# EasyEDA Pro project PCB.epro

# Board PCB1
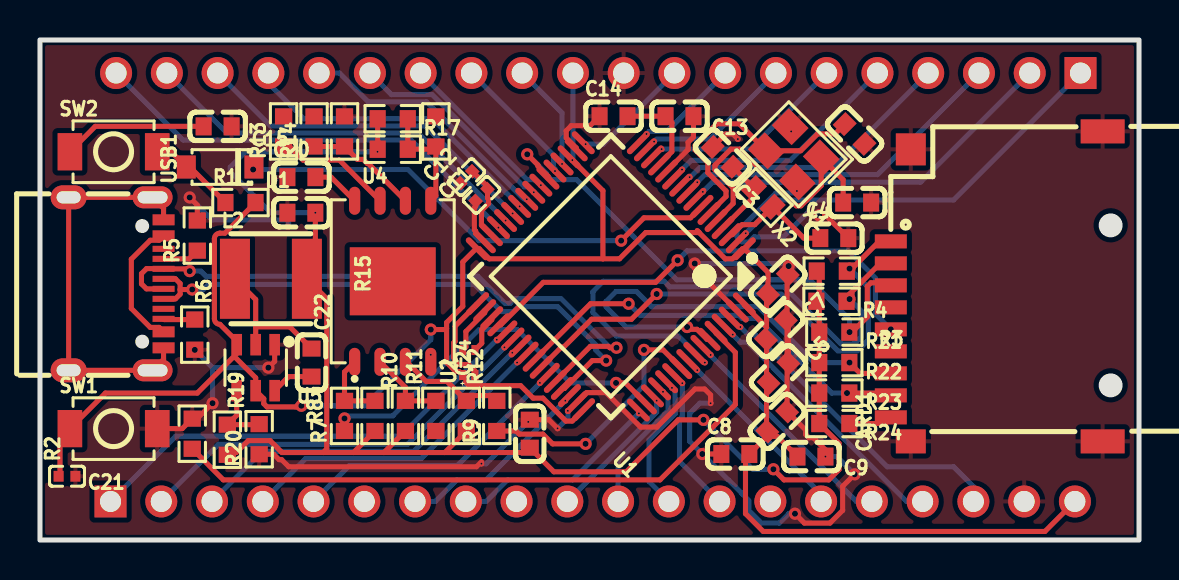
[diagram p0: board, top side]
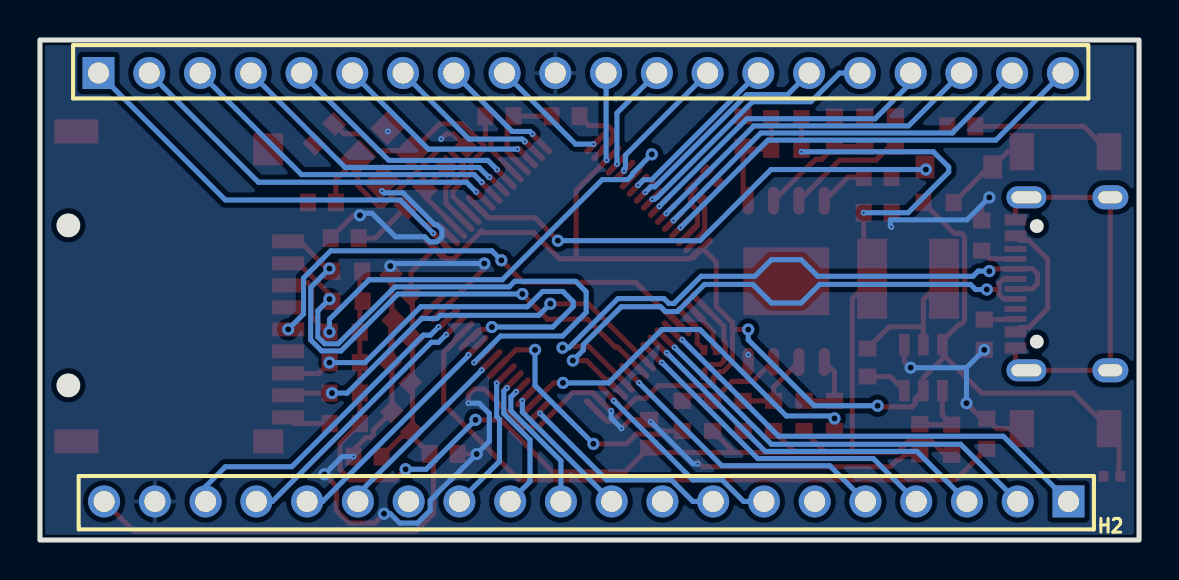
[diagram p1: board, bottom side, seen from below]

Outline 55 x 25 mm; copper layers: Top Layer, Bottom Layer. Coordinates in mm from the lower left corner of the outline.
Outline path: rectangle 0,25 55,0
Stack: Top Layer 0.035mm / Dielectric1 1.51mm FR4 er 4.5 / Bottom Layer 0.035mm

## Design rules (mm)
spacing copperThickness1oz (default): track to track 0.102, other pairs 0.152 to 0.3
spacing copperThickness2oz: track to track 0.203, other pairs 0.152 to 0.3
track width copperThickness1oz (default): min 0.127, default 0.254, max 2.54
track width copperThickness2oz: min 0.203, default 0.254, max 2.54
differential pair differentialPair (default): width min 0.127, default 0.254, max 2.54; gap min 0.152, default 0.152
net GND uses copperRegion

## Placement (name value [footprint] x y rotation side)
C1  20pF  [C0603]  40.77 20.3 135 top
C2  3.9pF  [C0603]  40.89 16.87 0 top
C3  6.8pF  [C0603]  34.16 19.16 135 top
C4  6.8pF  [C0603]  39.75 15.09 0 top
C5  100nF  [C0603]  36.96 8.36 225 top
C6  100nF  [C0603]  36.93 12.79 225 top
C7  100nF  [C0603]  36.83 10.52 225 top
C8  100nF  [C0603]  34.8 4.3 0 top
C9  100nF  [C0603]  38.61 4.17 180 top
C10  100nF  [C0603]  36.89 5.93 225 top
C11  10nF  [C0402]  22.1 17.25 45 top
C12  10nF  [C0402]  21.34 18.14 45 top
C13  100nF  [C0603]  32 21.19 180 top
C14  1uF  [C0603]  28.7 21.19 0 top
C15  100nF  [C0603]  8.89 20.68 180 top
C20  100nF  [C0603]  13.08 18.14 0 top
C21  4.7uF  [C0402]  1.35 3.19 180 top
C22  100nF  [C0603]  13.59 8.87 270 top
C23  100nF  [C0603]  13.08 16.36 0 top
C24  100nF  [C0603]  24.51 5.31 270 top
CARD1  TF PUSH  [TF-SMD_TF-PUSH]  47.88 12.68 90 top
D1  1N4148W  [SOD-123_L2.8-W1.8-LS3.7-RD]  9.02 18.65 180 top
H1  PH2.54-1X20P-H25  [HDR-TH_20P-P2.54-V-M_4]  27.94 23.35 180 bottom
H2  PH2.54-1X20P-H25  [HDR-TH_20P-P2.54-V-M_4]  27.66 1.93 0 bottom
L2  2.2uH  [IND-SMD_L4.0-W4.0_LQH44PN2R2MP0L]  11.56 13.06 0 top
R1  10kΩ  [R0603]  10.03 16.87 0 top
R2  10kΩ  [R0603]  7.62 5.31 90 top
R3  10kΩ  [R0603]  39.62 13.44 180 top
R4  10kΩ  [R0603]  39.61 11.94 180 top
R5  4.7kΩ  [R0603]  7.87 15.22 90 top
R6  4.7kΩ  [R0603]  7.75 10.27 270 top
R7  50  [R0603]  15.24 6.2 90 top
R8  50  [R0603]  19.81 6.2 90 top
R9  50  [R0603]  22.86 6.2 90 top
R10  10kΩ  [R0603]  16.76 6.2 270 top
R11  10kΩ  [R0603]  18.29 6.2 270 top
R12  10kΩ  [R0603]  21.34 6.2 270 top
R13  50  [R0603]  12.19 20.43 90 top
R14  50  [R0603]  13.72 20.43 90 top
R15  50  [R0603]  19.81 20.43 90 top
R16  10kΩ  [R0603]  17.65 19.54 180 top
R17  10kΩ  [R0603]  17.65 21.06 180 top
R18  100kΩ  [R0603]  15.24 20.43 270 top
R19  100kΩ  [R0603]  9.38 5.02 270 top
R20  22.1kΩ  [R0603]  10.97 5.04 90 top
R21  10kΩ  [R0603]  39.75 10.39 180 top
R22  10kΩ  [R0603]  39.75 8.87 180 top
R23  10kΩ  [R0603]  39.75 7.35 180 top
R24  10kΩ  [R0603]  39.75 5.82 180 top
SW1  TS-1088-AR02016  [SW-SMD_L3.9-W3.0-P4.45]  3.68 5.57 0 top
SW2  TS-1088-AR02016  [SW-SMD_L3.9-W3.0-P4.45]  3.68 19.41 0 top
U1  STM32F722RET6  [LQFP-64_L10.0-W10.0-P0.50-LS12.0-BL]  28.58 13.19 135 top
U2  APHF1608LSEEQBDZGKC  [LED-SMD_4P-L1.6-W0.8_APHF1608LSEEQBDZGKC]  21.46 8.87 90 top
U4  W25Q256JVEIQ  [WSON-8_L8.0-W6.10-P1.27-BL-EP]  17.65 12.94 0 top
U5  LMR51430XDDCR  [SOT-23-6_L2.9-W1.6-P0.95-LS2.8-BL]  10.8 8.62 180 top
USB1  TYPE-C 16PIN 2MD(073)  [USB-C-SMD_TYPE-C-16PIN-2MD-073]  3.81 12.81 270 top
X1  25MHz  [CRYSTAL-SMD_4P-L3.2-W2.5-BL]  37.72 19.28 135 top
X2  32.768kHz  [OSC-SMD_2P-L1.6-W1.0]  36.2 17.13 135 top

## Footprints (pads in the part's own frame, mm; a bottom-side part is the same pattern mirrored in y, then rotated)
C0402
  rect 0.5x0.54 smd: 1(-0.42,0) 2(0.42,0)
C0603
  rect 0.8x0.9 smd: 1(-0.7,0) 2(0.7,0)
CRYSTAL-SMD_4P-L3.2-W2.5-BL
  rect 1.4x1.2 smd: 1(-1.1,-0.85) 2(1.1,-0.85) 3(1.1,0.85) 4(-1.1,0.85)
HDR-TH_20P-P2.54-V-M_4
  rect 1.6x1.6 hole 1.05: 1(-24.13,0)
  round 1.6 hole 1.05: 2(-21.59,0) 3(-19.05,0) 4(-16.51,0) 5(-13.97,0) 6(-11.43,0) 7(-8.89,0) 8(-6.35,0) 9(-3.81,0) 10(-1.27,0) 11(1.27,0) 12(3.81,0) 13(6.35,0) 14(8.89,0) 15(11.43,0) 16(13.97,0) 17(16.51,0) 18(19.05,0) 19(21.59,0) 20(24.13,0)
IND-SMD_L4.0-W4.0_LQH44PN2R2MP0L
  rect 1.5x4 smd: 1(-1.8,0) 2(1.8,0)
LED-SMD_4P-L1.6-W0.8_APHF1608LSEEQBDZGKC
  rect 0.5x0.35 smd: 1(-0.625,0.305) 2(-0.625,-0.305) 3(0.625,-0.305) 4(0.625,0.305)
LQFP-64_L10.0-W10.0-P0.50-LS12.0-BL
  oval 0.3x1.5 smd: 1(-3.75,-5.688) 2(-3.25,-5.688) 3(-2.75,-5.688) 4(-2.25,-5.688) 5(-1.75,-5.688) 6(-1.25,-5.688) 7(-0.75,-5.688) 8(-0.25,-5.688) 9(0.25,-5.688) 10(0.75,-5.688) 11(1.25,-5.688) 12(1.75,-5.688) 13(2.25,-5.688) 14(2.75,-5.688) 15(3.25,-5.688) 16(3.75,-5.688) 33(3.75,5.688) 34(3.25,5.688) 35(2.75,5.688) 36(2.25,5.688) 37(1.75,5.688) 38(1.25,5.688) 39(0.75,5.688) 40(0.25,5.688) 41(-0.25,5.688) 42(-0.75,5.688) 43(-1.25,5.688) 44(-1.75,5.688) 45(-2.25,5.688) 46(-2.75,5.688) 47(-3.25,5.688) 48(-3.75,5.688)
  oval 1.5x0.3 smd: 17(5.7,-3.738) 18(5.7,-3.238) 19(5.7,-2.738) 20(5.7,-2.238) 21(5.7,-1.738) 22(5.7,-1.238) 23(5.7,-0.739) 24(5.7,-0.238) 25(5.7,0.262) 26(5.7,0.762) 27(5.7,1.262) 28(5.7,1.762) 29(5.7,2.261) 30(5.7,2.762) 31(5.7,3.261) 32(5.7,3.762) 49(-5.7,3.762) 50(-5.7,3.261) 51(-5.7,2.762) 52(-5.7,2.261) 53(-5.7,1.762) 54(-5.7,1.262) 55(-5.7,0.762) 56(-5.7,0.262) 57(-5.7,-0.238) 58(-5.7,-0.739) 59(-5.7,-1.238) 60(-5.7,-1.738) 61(-5.7,-2.238) 62(-5.7,-2.738) 63(-5.7,-3.238) 64(-5.7,-3.738)
OSC-SMD_2P-L1.6-W1.0
  rect 0.8x1.06 smd: 1(-0.66,0) 2(0.66,0)
R0603
  rect 0.806x0.864 smd: 1(-0.753,0) 2(0.753,0)
SOD-123_L2.8-W1.8-LS3.7-RD
  rect 0.95x1.15 smd: 1(-1.692,0) 2(1.692,0)
SOT-23-6_L2.9-W1.6-P0.95-LS2.8-BL
  rect 0.532x1.072 smd: 1(-0.95,-1.149) 2(0,-1.149) 3(0.95,-1.149) 4(0.95,1.149) 5(0,1.149) 6(-0.95,1.149)
SW-SMD_L3.9-W3.0-P4.45
  rect 1.23x1.86 smd: 1(-2.185,0) 2(2.185,0)
TF-SMD_TF-PUSH
  rect 0.7x1.6 smd: 1(2.25,5.3) 2(1.15,5.3) 3(0.05,5.3) 4(-1.05,5.3) 5(-2.15,5.3) 6(-3.25,5.3) 7(-4.35,5.3) 8(-5.45,5.3) CD(-6.55,5.3)
  rect 1.2x1.5 smd: 10(-7.75,4.3)
  rect 1.2x2.2 smd: 11(-7.75,-5.3) 12(7.75,-5.3)
  rect 1.6x1.5 smd: 13(6.85,4.3)
USB-C-SMD_TYPE-C-16PIN-2MD-073
  oval 1.1x2 hole 0.6x1.5: 13(-4.325,1.825) 14(4.325,1.825)
  oval 1.2x1.8 hole 0.6x1.2: 13(-4.325,-2.375) 14(4.325,-2.375)
  rect 0.55x1.1 smd: A1B12(-3.2,2.375) A4B9(-2.4,2.375) B1A12(3.2,2.375) B4A9(2.4,2.375)
  rect 0.3x1.1 smd: A5(-1.25,2.375) A6(-0.25,2.375) A7(0.25,2.375) A8(1.25,2.375) B5(1.75,2.375) B6(0.75,2.375) B7(-0.75,2.375) B8(-1.75,2.375)
WSON-8_L8.0-W6.10-P1.27-BL-EP
  oval 0.56x1.4 smd: 1(-1.905,-4.027) 2(-0.635,-4.027) 3(0.635,-4.027) 4(1.905,-4.027) 5(1.905,4.027) 6(0.635,4.027) 7(-0.635,4.027) 8(-1.905,4.027)
  rect 4.3x3.4 smd: 9(0,0)

## Nets
+3.3V: C23.2 C24.2 L2.2 R3.2 R4.2 R10.2 R11.2 R12.2 R16.2 R17.2 R19.2 R21.2 R22.2 R23.2 R24.2
GND: C1.1 C2.2 C3.2 C4.2 C5.1 C6.1 C7.1 C8.1 C9.1 C10.1 C11.1 C12.1 C13.1 C14.1 C15.1 C20.1 C21.1 C23.1 C24.1 CARD1.10 CARD1.11 CARD1.12 CARD1.13 H1.10 H2.19 R2.2 R5.2 R6.2 R18.1 R20.1 SW1.2 U1.12 U1.18 U1.31 U1.47 U1.63 U4.4 U5.1 X1.2 X1.4
VCC: C5.2 C6.2 C7.2 C8.2 C9.2 C10.2 C21.2 H1.11 H2.20 R1.2 SW1.1 U1.1 U1.19 U1.32 U1.48 U1.64 U2.1 U5.3 U5.5
VDDA: C13.2 C14.2 U1.13
B: U1.35 U2.3
BOOT: R2.1 U1.60
D+: U1.45 USB1.A6 USB1.B6
D-: U1.44 USB1.A7 USB1.B7
FLASH_CS: R7.1 U1.50
FLASH_IO0: R15.2
FLASH_IO1: R8.1
FLASH_IO2: R9.1 U1.55
FLASH_IO3: R13.2
FLASH_SCK: R14.2
G: U1.34 U2.4
HSE_IN: C2.1 U1.5 X1.1
HSE_OUT: C1.2 U1.6 X1.3
LSE_IN: C4.1 U1.3 X2.1
LSE_OUT: C3.1 U1.4 X2.2
PA0: H1.6 U1.14
PA1: H1.7 U1.15
PA2: H1.8 U1.16
PA3: H1.9 U1.17
PA4: H1.12 U1.20
PA5: H1.13 U1.21
PA7: H1.14 U1.23
PA10: H2.5 U1.43
PA11: H2.6
PA13: H2.7 U1.46
PA14: H2.8 U1.49
PA15: H2.9
PB0: H1.16 U1.25
PB1: H1.17 U1.26
PB2: H1.18 U1.27
PB3: H2.14
PB4: H2.15 U1.56
PB6: H2.16 U1.58
PB8: H2.17 U1.61
PB9: H2.18 U1.62
PB10: H1.19 U1.28
PB11: H1.20 U1.29
PC0: H1.2 U1.8
PC1: H1.3 U1.9
PC2: H1.4 U1.10
PC3: H1.5 U1.11
PC4: H1.15 U1.24
PC6: H2.1 U1.37
PC7: H2.2 U1.38
PC8: H2.3 U1.39
PC9: H2.4 U1.40
PC10: H2.10 U1.51
PC11: H2.11 U1.52
PC12: H2.12 U1.53
PC13: H1.1 U1.2
PD2: H2.13 U1.54
R: U1.33 U2.2
RESET: D1.1 U1.7
SD_CD: CARD1.CD R24.1
SD_CMD: CARD1.3 R21.1 U1.22
SD_DAT0: CARD1.7 R22.1 U1.59
SD_DAT1: CARD1.8 R23.1 U1.41
SD_DAT2: CARD1.1 R3.1 U1.42
SD_DAT3: CARD1.2 R4.1 U1.57
SD_SCK: CARD1.5 U1.36
VCAP: C11.2 C12.2 U1.30
$1N52: D1.2 R1.1 SW2.2
$1N54: C15.2 SW2.1
$1N78: USB1.13 USB1.14 USB1.A1B12 USB1.B1A12
$1N80: USB1.A4B9 USB1.B4A9
$1N83: R5.1 USB1.A5
$1N85: R6.1 USB1.B5
$1N89: R7.2 R10.1 U4.1
$1N90: R8.2 R11.1 U4.2
$1N91: R9.2 R12.1 U4.3
$1N96: R13.1 U4.7
$1N98: R15.1 R16.1 R17.1 U4.5
$1N102: R14.1 R18.2 U4.6
$1N105: C20.2 U4.8
$1N110: C22.2 U5.6
$1N111: C22.1 L2.1 U5.2
$1N112: R19.1 R20.2 U5.4

Pads without a net: CARD1 4 6; U4 9; USB1 A8 B8

## Via types
v1: diameter 0.3, hole 0.1, Top Layer to Bottom Layer, 48 vias
v2: diameter 0.61, hole 0.305, Top Layer to Bottom Layer, 35 vias

## Routing (per net, layer and track width the routed paths; a pad name or vN(x,y) marks a point on that pad's centre or on a via; arc(x,y) is an arc through that point)
+3.3V: length 76.4
  Top Layer w0.254: 20.26,4.37 24.27,4.37 C24.2 25.72,3.41 29.34,3.41 31.94,6.01 v2(33.2,6.01) ; 20.26,4.37 R12.2 ; 20.26,4.37 17.21,4.37 ; v2(36.7,3.54) 37.23,3.01 39.47,3.01 39.99,3.52 39.99,4.83 R24.2 R23.2 R22.2 R21.2 39,13.44 ; R17.2 R16.2 ; 15.69,4.37 17.21,4.37 ; 15.69,4.37 R10.2 ; 15.69,4.37 14.17,4.37 ; 17.21,4.37 R11.2 ; v1(13.78,16.36) 13.78,13.49 13.36,13.06 14.35,12.07 14.35,4.55 14.17,4.37 ; 14.17,4.37 12.11,4.37 11.52,4.97 10.42,4.97 9.83,4.37 9.49,4.37 R19.2
  Bottom Layer w0.254: v2(36.7,3.54) 35.67,3.54 v2(33.2,6.01) ; v1(13.78,16.36) 11.56,16.36 9.52,18.4 9.52,18.65 10.29,19.41 v1(16.89,19.41)
GND: length 103.1
  Top Layer w0.254: v1(33.56,6.84) 33.56,7.25 33.26,7.55 32.78,7.55 30.87,5.64 30.05,5.64 28.33,7.37 27.35,7.37 U1.47 ; R5.2 7.87,16.75 v2(7.49,17.13) ; C14.1 27.53,20.72 26.59,20.72 26.33,20.47 26.33,20.11 26.83,19.61 26.83,19.51 ; U5.1 11.74,8.93 v2(11.43,8.62) ; 40.45,15.09 39.31,16.24 v2(38.99,16.24) ; R20.1 11.69,4.29 11.96,4.02 12.09,4.02 12.45,3.66 21.84,3.66 22.1,3.92 ; 37.42,13.28 37.39,13.25 C10.1 38.32,5.5 38.32,5.28 38.48,5.11 38.7,5.11 39.31,4.51 v1(39.31,4.17) ; 25.91,5.57 25.46,6.02 C24.1 ; 22.24,14.91 21.8,15.35 21.8,15.45 21.74,15.52 21.74,16.62 21.8,16.68 21.8,16.96 ; v2(8.64,6.84) 7.87,6.07 R2.2 7.12,5.57 SW1.2 ; C3.2 34.32,20.3 34.67,20.3 v1(34.92,20.05) ; v2(40.77,3.28) 40.17,2.69 40.17,1.48 39.54,0.85 38.25,0.85 v2(37.78,1.31) ; U1.12 32.43,19.52 32.43,19.88 32.7,20.15 C13.1 ; U1.63 32.77,13.58 v2(32.77,13.82) ; C8.1 v2(33.15,4.3) ; C5.1 37.45,11.02
  Bottom Layer w0.254: 8.64,8.62 v2(7.75,9.51) ; 8.64,8.62 v2(11.43,8.62) ; 8.64,8.62 v2(8.64,6.84) ; v1(33.56,6.84) 33.02,6.84 32.51,6.33 32.51,4.93 v2(33.15,4.3) 34.44,3.01 34.46,3.01 35.09,2.37 35.09,2.36 35.47,1.97 35.47,1.48 36.1,0.85 37,0.85 37.46,1.31 v2(37.78,1.31) ; v2(32.77,13.82) 37.34,13.82 v2(37.46,13.7) ; v1(39.31,4.17) 39.88,4.17 v2(40.77,3.28) ; v1(25.9,5.58) 26.42,6.1 v1(26.42,6.46) ; v1(12.4,15.65) 12.45,15.7 12.45,16.01 8.61,16.01 v2(7.49,17.13) ; v1(37.88,17.45) 37.79,17.36 36.83,17.36 35.24,15.77 35.14,15.77 34.89,15.51 34.89,15.16 35.14,14.91 35.5,14.91 35.75,15.16 37.2,15.16 38.39,16.34 38.88,16.34 v2(38.99,16.24) ; 24.43,5.92 22.32,3.81 22.09,3.81
  vias: v1(19.56,9.26) v1(22.09,3.82) v1(24.43,5.91) v1(37.59,20.43)
VCC: length 109.8
  Top Layer w0.254: 36.38,5.18 36.36,5.18 36.36,10.03 ; 36.38,5.18 36.4,5.2 C10.2 ; 36.38,5.18 36.9,5.18 C9.2 ; 36.38,5.18 C8.2 35.31,4.11 35.31,1.32 36.2,0.43 50.29,0.43 H2.20 ; 9.72,9.19 7.87,7.35 3.28,7.35 SW1.1 ; 1.38,5.11 1,4.73 1,3.1 ; 32.98,15.37 32.98,15.39 32.89,15.47 ; 32.98,15.37 34.29,14.06 34.65,14.06 35.15,14.56 U1.1 36.43,13.38 36.43,12.29 36.36,12.22 36.36,10.64 35.25,11.75 U1.64 ; 32.98,15.37 30.31,15.37 29,14.06 28.17,14.06 ; 28.17,14.06 22.48,14.06 21.98,14.56 U1.32 21.82,14.56 21.16,13.9 21.16,11.68 20.35,10.87 20.35,10.57 ; 28.17,14.06 28.17,17.46 v1(26.64,18.99) U1.19 ; v2(13.08,6.71) 12.87,6.71 12.81,6.65 11.36,6.65 11.2,6.82 11.2,7.06 U5.5 10.8,8.11 9.78,9.12 ; 20.35,10.57 20.3,10.52 v2(19.56,10.52) ; 20.35,10.57 20.35,8.88 20.81,8.42 20.98,8.42 U2.1 21.31,8.09 21.31,7.88 21.48,7.72 24.05,7.72 24.68,7.09 25.17,7.09 26.32,5.95 26.64,5.95 U1.48 ; R1.2 9.26,15.34 9.01,15.34 arc(8.81,15.26) 8.73,15.06 8.73,11.06 arc(8.81,10.86) 9.01,10.78 9.84,9.94 9.84,9.32
  Bottom Layer w0.254: v2(13.08,6.71) 16.26,6.71 19.56,10.01 v2(19.56,10.52) ; H1.11 26.67,19.03
VDDA: length 4.7
  Top Layer w0.254: U1.13 31.62,19.42 31.62,20.87 C13.2 C14.2
B: length 2
  Top Layer w0.254: U1.35 22.61,11.01 22.11,10.51 22.11,9.84 U2.3
BOOT: length 33.4
  Top Layer w0.254: U1.60 33.83,10.34 34.8,9.38 34.8,6.78 31.03,3.01 9.18,3.01 R2.1
D+: length 29.3
  Top Layer w0.254: 7.01,12.52 7.01,12.82 6.78,13.06 6.19,13.06 USB1.A6 ; 7.01,12.52 v2(7.62,12.52) ; 7.01,12.52 7.01,12.29 6.78,12.06 USB1.B6 ; v2(28.33,8.97) 27.64,8.97 26.24,7.58 U1.45
  Bottom Layer w0.254: v2(7.62,12.52) 8.18,12.52 8.44,12.78 15.98,12.78 16.91,11.85 18.39,11.85 19.32,12.78 21.74,12.78 23.11,11.42 23.7,11.42 23.94,11.66 25.91,11.66 27.81,9.76 27.81,9.49 v2(28.33,8.97)
D-: length 31.9
  Top Layer w0.254: USB1.A7 5.33,12.56 5.08,12.81 5.08,13.32 5.33,13.57 6.17,13.57 USB1.B7 7.38,13.56 v2(7.49,13.44) ; U1.44 27.54,9.68 28.45,9.68 28.52,9.61 v2(28.85,9.61)
  Bottom Layer w0.254: v2(7.49,13.44) 8.05,13.44 8.31,13.19 16.08,13.19 16.91,14.02 18.39,14.02 19.23,13.19 21.91,13.19 23.27,11.83 23.53,11.83 23.77,12.07 26.08,12.07 28.53,9.61 v2(28.85,9.61)
FLASH_CS: length 19
  Top Layer w0.254: R7.1 v2(15.24,6.08) ; v2(28.83,7.86) 29.3,7.86 U1.50
  Bottom Layer w0.254: v2(28.83,7.86) 26.54,7.86 23.88,10.52 21.97,10.52 17.65,6.2 15.24,6.2
FLASH_IO2: length 12.8
  Top Layer w0.254: v2(27.3,4.81) 25.65,4.81 25.17,5.29 23.99,5.29 23.83,5.45 R9.1 ; v2(30.23,9.51) 31.18,9.51 32.07,8.62
  Bottom Layer w0.254: v2(27.3,4.81) 30.23,7.73 v2(30.23,9.51)
G: length 2.4
  Top Layer w0.254: 22.26,11.47 22.26,11.36 21.31,10.42 21.31,9.65 U2.4
HSE_IN: length 14.8
  Top Layer w0.254: C2.1 40.19,18.01 X1.1 39.09,19.1 39.09,17.72 38.08,16.71 37.85,16.71 35.02,19.54 34.58,19.54 33.78,18.74 33.78,18.51 34.69,17.6 34.69,16.83 U1.5
HSE_OUT: length 13.4
  Top Layer w0.254: C1.2 39.78,20.31 38.91,20.31 38.07,19.46 X1.3 34.99,20.81 33.86,20.81 32.79,19.73 32.79,19.5 33.42,18.87 33.42,18.36 34.33,17.45 34.33,17.18 U1.6
LSE_IN: length 5.7
  Top Layer w0.254: C4.1 38.23,15.09 X2.1 35.77,15.77 35.14,15.77 34.64,15.27 U1.3
LSE_OUT: length 4.1
  Top Layer w0.254: U1.4 35.73,17.16 X2.2 C3.1
PA0: length 9.8
  Bottom Layer w0.254: H1.6 35.57,19.54 v1(31.11,19.54)
PA1: length 7.5
  Bottom Layer w0.254: H1.7 33.53,20.05 30.86,20.05 v1(30.73,19.92)
PA2: length 5.2
  Bottom Layer w0.254: H1.8 31.37,20.43 30.48,20.43 v1(30.35,20.3)
PA3: length 5.9
  Bottom Layer w0.254: v1(27.3,19.79) 28.19,19.79 H1.9
PA4: length 5.4
  Bottom Layer w0.254: H1.12 26.13,21.35 v1(26.13,18.8)
PA5: length 6.6
  Bottom Layer w0.254: H1.13 25.7,19.24 25.7,18.62 25.77,18.55 v1(25.77,18.45)
PA7: length 8.3
  Bottom Layer w0.254: v1(25.07,17.74) 24.79,18.02 24.38,18.02 H1.14
PA10: length 13.8
  Bottom Layer w0.254: H2.5 15.48,3.72 20.88,3.72 v1(25.02,7.86)
PA13: length 9.6
  Bottom Layer w0.254: H2.7 19.78,1.93 20.86,3.01 22.33,3.01 v1(26.29,6.97)
PA14: length 10.5
  Bottom Layer w0.254: H2.8 22.32,1.93 23.4,3.01 26.65,3.01 v1(29.97,6.33)
PB0: length 13
  Bottom Layer w0.254: v1(24.36,17.03) 24.26,17.03 24.18,17.11 24.15,17.11 19.34,21.91 16.42,21.91 14.98,23.35 H1.16
PB1: length 15.6
  Bottom Layer w0.254: v1(24.01,16.68) 19.62,21.06 13.21,21.06 11.43,22.84 H1.17
PB2: length 17.7
  Bottom Layer w0.254: H1.18 11.53,20.71 19.27,20.71 v1(23.65,16.33)
PB4: length 9.1
  Bottom Layer w0.254: v1(32.89,8.49) 39.09,2.29 H2.15
PB6: length 11.1
  Bottom Layer w0.254: H2.16 40.85,1.93 33.53,9.25
  vias: v1(33.56,9.25)
PB8: length 13
  Bottom Layer w0.254: H2.17 43.37,1.93 35.41,9.89 35.05,9.89 v1(34.67,10.27)
PB9: length 15.7
  Bottom Layer w0.254: H2.18 46.71,2.67 45.72,3.66 42.4,3.66 35.82,10.24 35.46,10.24 v1(35.05,10.65)
PB10: length 20
  Bottom Layer w0.254: v1(23.3,15.97) 18.92,20.35 9.35,20.35 H1.19
PB11: length 22.3
  Bottom Layer w0.254: v1(22.95,15.62) 18.57,20 7.16,20 H1.20
PC0: length 18.8
  Bottom Layer w0.254: H1.2 44.07,17.89 33.65,17.89 v1(33.17,17.41)
PC1: length 16.4
  Bottom Layer w0.254: v1(32.89,17.89) 33.27,18.27 41.91,18.27 H1.3
PC2: length 14.1
  Bottom Layer w0.254: v1(32.51,18.14) 32.54,18.14 33.02,18.62 39.73,18.62 H1.4
PC3: length 11.8
  Bottom Layer w0.254: H1.5 37.54,18.98 32.59,18.98 v1(32.13,18.52)
PC4: length 10.7
  Bottom Layer w0.254: H1.15 17.59,22.27 19.63,22.27 24.24,17.66 24.44,17.66 v1(24.71,17.39)
PC6: length 22.7
  Bottom Layer w0.254: v1(22.86,10.01) 18.03,5.19 6.79,5.19 H2.1
PC7: length 20.4
  Bottom Layer w0.254: v1(23.24,9.63) 18.39,4.79 8.93,4.79 H2.2
PC8: length 18.1
  Bottom Layer w0.254: v1(23.64,9.36) 18.7,4.43 11.11,4.43 H2.3
PC9: length 15.6
  Bottom Layer w0.254: v1(23.88,8.87) 19.08,4.07 13.3,4.07 H2.4
PC10: length 6.9
  Bottom Layer w0.254: v1(30.86,6.97) 30.86,6.4 H2.10
PC11: length 6.6
  Bottom Layer w0.254: v1(31.18,7.41) 31.43,7.16 31.43,6.47 28.93,3.96 H2.11
PC12: length 6.7
  Bottom Layer w0.254: H2.12 30.48,2.92 30.48,5.01 31.79,6.32 31.79,7.44 v1(31.63,7.61)
PC13: length 20.1
  Bottom Layer w0.254: H1.1 45.72,17 36.98,17 v1(35.32,15.34)
PD2: length 6.8
  Bottom Layer w0.254: H2.13 32,3.93 32,6.03 32.14,6.17 v1(32.14,7.84)
R: length 4.8
  Top Layer w0.254: 21.9,11.82 20.78,10.69 20.78,9.93 20.7,9.86 20.7,9.13 20.78,9.06 20.78,8.95 20.95,8.78 21.45,8.78 21.77,8.46 U2.2
RESET: length 24.6
  Top Layer w0.254: U1.7 32.56,16.11 30.23,16.11 v2(29.08,14.97)
  Bottom Layer w0.254: v2(10.67,18.52) 18.42,18.52 21.97,14.97 v2(29.08,14.97)
SD_CD: length 2.2
  Top Layer w0.254: CARD1.CD 42.27,5.82 R24.1
SD_CMD: length 25.9
  Top Layer w0.254: R21.1 40.64,10.39 41.4,11.16 41.4,12.68 41.58,12.86 42.45,12.86 CARD1.3 ; v2(24.38,19.28) 24.92,18.75 24.92,18.69 25.42,18.2 25.42,18.09
  Bottom Layer w0.254: v2(24.38,19.28) 25.34,18.32 25.34,18.27 25.6,18.02 26.86,18.02 31.86,13.01 38.53,13.01 40.51,11.03 v2(40.51,10.39)
SD_DAT0: length 22.3
  Top Layer w0.254: U1.59 33.38,10.03 32.88,10.53 32.5,10.53 v2(32.39,10.65) ; CARD1.7 41.04,8.33 R22.1
  Bottom Layer w0.254: v2(32.39,10.65) 29.34,10.65 28.32,11.66 28.32,11.92 28.83,12.43 29.84,12.43 30.61,11.66 35.94,11.66 38.73,8.87 v2(40.51,8.87)
SD_DAT1: length 20.8
  Top Layer w0.254: R23.1 42.46,7.35 CARD1.8 ; U1.41 27.55,11.81 v2(29.46,11.81)
  Bottom Layer w0.254: v2(29.46,11.81) 30.04,11.23 34.98,11.23 35.13,11.08 35.89,11.08 39.62,7.35 v2(40.39,7.35)
SD_DAT2: length 25.9
  Top Layer w0.254: v2(30.86,12.3) 29.6,11.04 27.6,11.04 26.21,9.64 26.09,9.64 U1.42 ; CARD1.1 41.99,14.93 40.5,13.44
  Bottom Layer w0.254: v2(30.86,12.3) 37.09,12.3 39.93,9.45 40.9,9.45 41.45,10.01 41.45,12.63 v2(40.51,13.57)
SD_DAT3: length 27.8
  Top Layer w0.254: CARD1.2 42.05,13.83 40.51,12.3 v2(40.51,12.05)
  Bottom Layer w0.254: v2(40.51,12.05) 41.1,11.46 41.1,10.15 40.76,9.81 40.08,9.81 37.24,12.66 31.52,12.66 31.24,12.94 28.19,12.94 27.67,12.41 27.67,11.38 28.85,10.2 31.95,10.2 v1(33.27,8.87)
SD_SCK: length 23.8
  Top Layer w0.254: U1.36 23.06,10.76 25.19,12.88 30.81,12.88 v2(31.91,13.98)
  Bottom Layer w0.254: v2(31.91,13.98) 32.39,14.46 40.45,14.46 41.81,13.1 41.81,11.3 v2(42.58,10.53)
VCAP: length 3.9
  Top Layer w0.254: U1.30 22.56,15.27 22.09,15.73 22.09,16.22 22.1,16.23 22.1,16.48 22.45,16.83 22.45,17.06 22.39,17.11 22.39,17.68 21.63,18.44
$1N52: length 4.5
  Top Layer w0.254: R1.1 7.5,18.65 D1.2 6.56,19.41 SW2.2
$1N54: length 7.2
  Top Layer w0.254: SW2.1 2.77,20.68 C15.2
$1N78: length 19.8
  Top Layer w0.254: USB1.B1A12 6.19,9.03 5.63,8.48 1.44,8.48 USB1.13 USB1.13 6.19,16.58 USB1.A1B12
$1N80: length 6.7
  Top Layer w0.254: USB1.B4A9 5.96,10.63 5.52,10.63 4.57,11.58 4.57,14.04 5.52,14.99 5.96,14.99 USB1.A4B9
$1N83: length 1.9
  Top Layer w0.254: R5.1 7.46,14.06 USB1.A5
$1N85: length 1.6
  Top Layer w0.254: R6.1 6.22,11.02 USB1.B5
$1N89: length 3.7
  Top Layer w0.254: U4.1 15.24,8.4 R7.2 R10.1
$1N90: length 4
  Top Layer w0.254: U4.2 18.29,7.64 R11.1 R8.2
$1N91: length 5.6
  Top Layer w0.254: R9.2 22.6,7.22 21.6,7.22 R12.1 20.36,7.93 19.33,7.93 18.35,8.91 U4.3
$1N96: length 5.9
  Top Layer w0.254: U4.7 14.99,18.99 13.17,18.99 12.49,19.67 R13.1
$1N98: length 5.8
  Top Layer w0.254: U4.5 19.81,17.22 R15.1 19.68,19.54 R16.1 R17.1
$1N102: length 5.7
  Top Layer w0.254: R14.1 R18.2 15.88,19.03 16.18,19.03 16.38,18.83 16.42,18.83 U4.6
$1N105: length 2.5
  Top Layer w0.254: U4.8 14.57,18.14 C20.2
$1N110: length 2.1
  Top Layer w0.254: C22.2 12.45,8.17 U5.6
$1N111: length 7
  Top Layer w0.254: 10.8,10.66 U5.2 ; 10.8,10.66 12.5,10.66 C22.1 ; 10.8,10.66 10.8,12.02 L2.1
$1N112: length 3.5
  Top Layer w0.254: 9.84,7.47 9.84,6.24 R19.1 10.94,5.77 10.97,5.79

## Copper pours and planes (outline as drawn; the poured copper is in the pictures)
GND on Top Layer: -1.65,26.4 56.52,26.4 56.52,-1.16 -1.65,-1.16
GND on Bottom Layer: -2.67,27.03 57.4,27.03 57.4,-2.31 -2.67,-2.31
